# EAGLE design Advanced IMU (EAGLE 6.5.0)
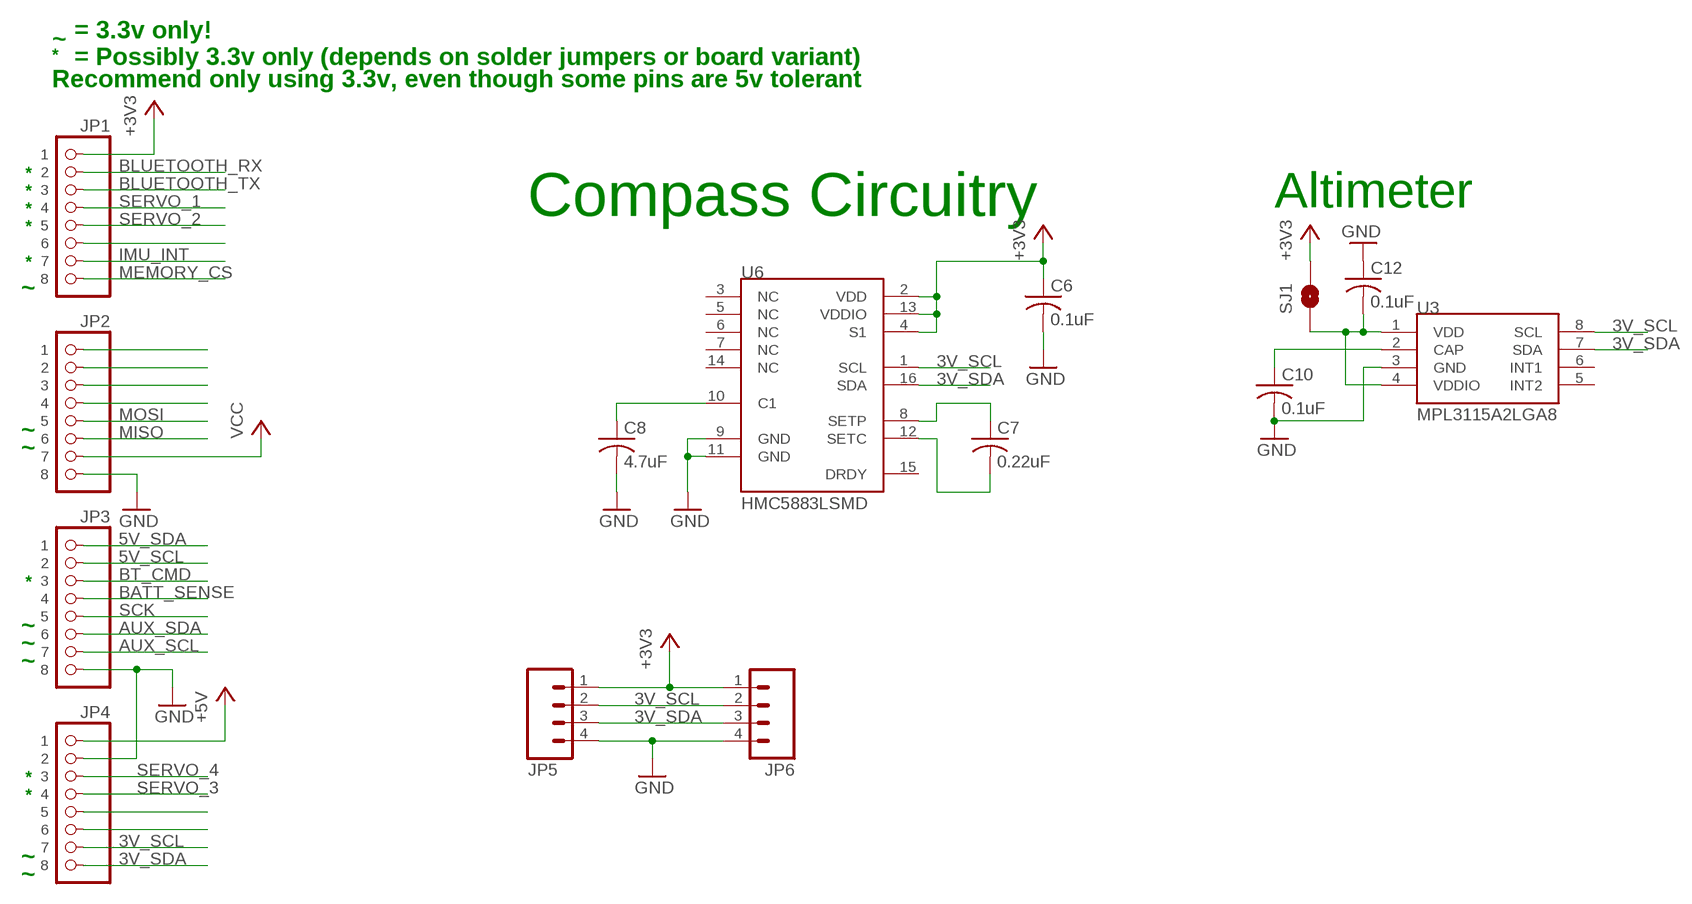
[diagram p0: schematic, sheet 1]

## Parts
C6  0.1uF  C-USC0603  [C0603]
C7  0.22uF  C-USC0603  [C0603]
C8  4.7uF  C-USC0603  [C0603]
C10  0.1uF  C-USC0603  [C0603]
C12  0.1uF  C-USC0603  [C0603]
JP1  8-PIN_HEADER  [8-PIN_RECEPTACLE_LOCK_NO-SS]
JP2  8-PIN_HEADER  [8-PIN_RECEPTACLE_LOCK_NO-SS]
JP3  8-PIN_HEADER  [8-PIN_RECEPTACLE_LOCK_NO-SS]
JP4  8-PIN_HEADER  [8-PIN_RECEPTACLE_LOCK_NO-SS]
JP5  M04PTH  [1X04]
JP6  M04PTH  [1X04]
SJ1  SOLDERJUMPERNC  [SJ_2S]
U3  MPL3115A2LGA8  [LGA8]
U6  HMC5883LSMD  [16LPCC]

## Nets
3V_SCL: JP4.P$7 JP5.2 JP6.2 U3.8(SCL) U6.1(SCL)
3V_SDA: JP4.P$8 JP5.3 JP6.3 U3.7(SDA) U6.16(SDA)
5V_SCL: JP3.P$2
5V_SDA: JP3.P$1
+3V3: C6.1 JP1.P$1 JP5.1 JP6.1 SJ1.2 U6.2(VDD) U6.4(S1) U6.13(VDDIO)
+5V: JP4.P$1
AUX_SCL: JP3.P$7
AUX_SDA: JP3.P$6
BATT_SENSE: JP3.P$4
BLUETOOTH_RX: JP1.P$2
BLUETOOTH_TX: JP1.P$3
BT_CMD: JP3.P$3
GND: C6.2 C8.2 C10.2 C12.1 JP2.P$8 JP3.P$8 JP4.P$2 JP5.4 JP6.4 U3.3(GND) U6.9(GND) U6.11(GND)
IMU_INT: JP1.P$7
MEMORY_CS: JP1.P$8
MISO: JP2.P$6
MOSI: JP2.P$5
N$1: C7.1 U6.8(SETP)
N$2: C7.2 U6.12(SETC)
N$3: C12.2 SJ1.1 U3.1(VDD) U3.4(VDDIO)
N$4: JP2.P$4
N$5: JP2.P$3
N$6: JP2.P$2
N$7: JP2.P$1
N$10: JP1.P$6
N$11: C8.1 U6.10(C1)
N$21: C10.1 U3.2(CAP)
N$26: JP4.P$5
N$27: JP4.P$6
SCK: JP3.P$5
SERVO_1: JP1.P$4
SERVO_2: JP1.P$5
SERVO_3: JP4.P$4
SERVO_4: JP4.P$3
VCC: JP2.P$7
Unconnected: U3.5(INT2) U3.6(INT1) U6.3(NC) U6.5(NC) U6.6(NC) U6.7(NC) U6.14(NC) U6.15(DRDY)

## Notes on the sheet
- = 3.3v only!
- ~
- * | = Possibly 3.3v only (depends on solder jumpers or board variant)
- Recommend only using 3.3v, even though some pins are 5v tolerant
- *
- *
- Altimeter
- * | Compass Circuitry
- *
- *
- ~
- ~
- ~
- *
- ~
- ~
- ~
- *
- *
- ~
- ~

## Library data of the parts
C6 C10 = resistor:C-US: CAPACITOR, American symbol; RATED_VOLTAGE: 2
C7 C8 = resistor:C-US: CAPACITOR, American symbol; ESR: <200mOhms
C12 = resistor:C-US: CAPACITOR, American symbol
JP1-JP4 = My Parts:8-PIN_HEADER
JP5 JP6 = SparkFun-Connectors:M04: Header 4 Standard 4-pin 0.1" header. Use with straight break away headers (SKU : PRT-00116), right angle break away headers (PRT-00553), swiss pins (PRT-00743), machine pins (PRT-00117), and female headers (PRT-00115). Molex polarized connector foot print use with SKU : PRT-08231 with associated crimp pins and housings. 1MM SMD Version SKU: PRT-10208
SJ1 = SparkFun-Passives:SOLDERJUMPER: Solder Jumper Standard SMD solder jumper. Used to automate production. Two varients : Normally Open and Normally Closed are the same, but have different paste layers. NC will have a large amount of paste and should jumper during reflow.
U3 = SparkFun-Sensors:MPL3115A2: Altimeter/Pressure Sensor, I2C, 1.95V-3.6V supply, 50 to 110kPa
U6 = SparkFun:HMC5883L: 3 Axis Digital Compass IC

## Board
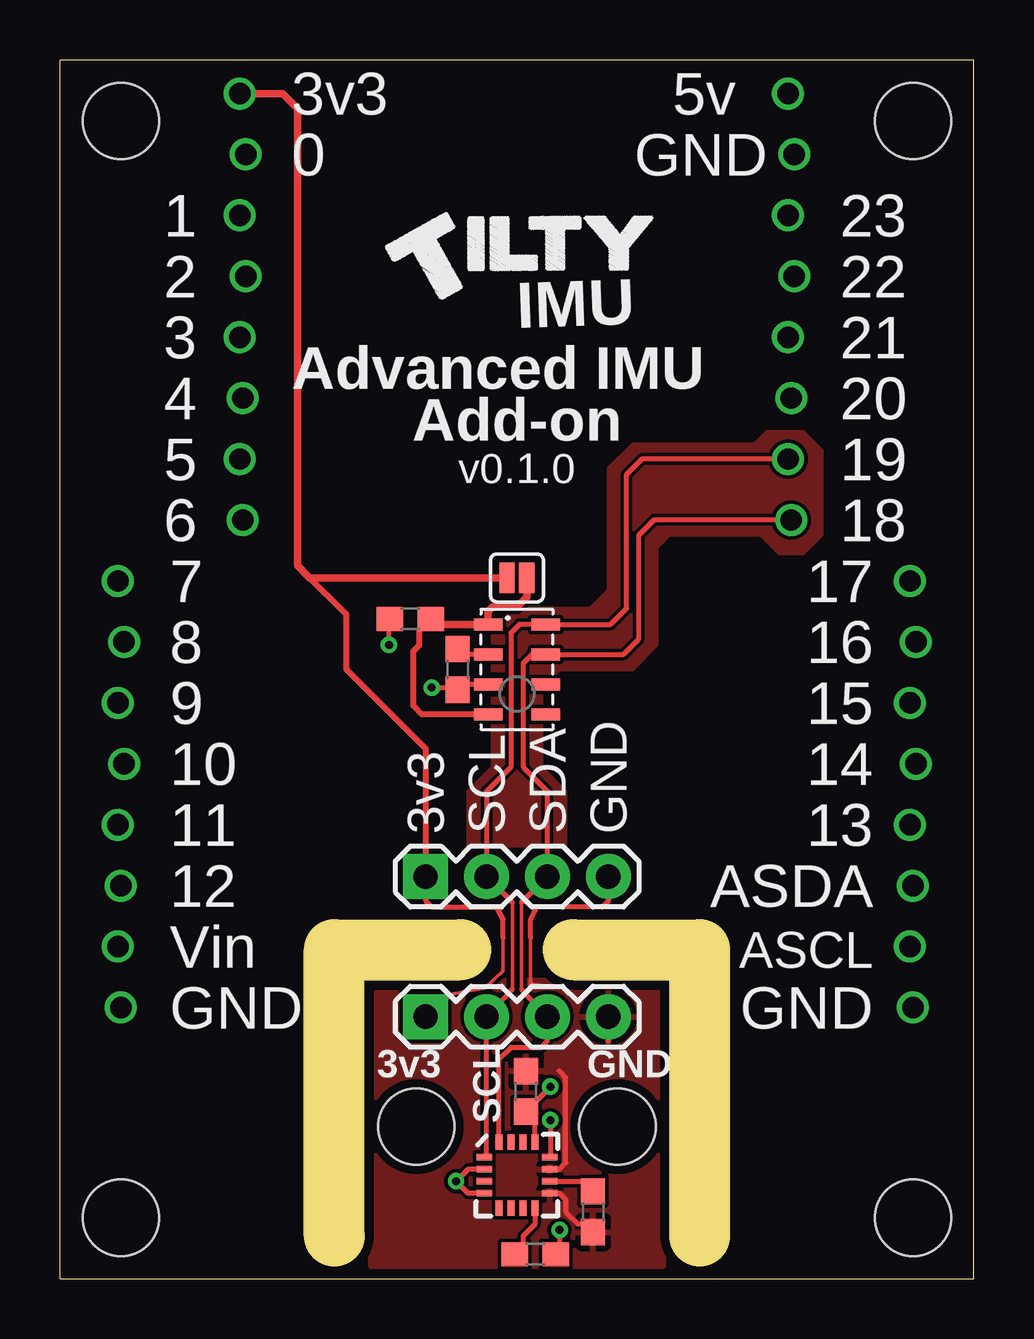
[diagram p1: board, top side]
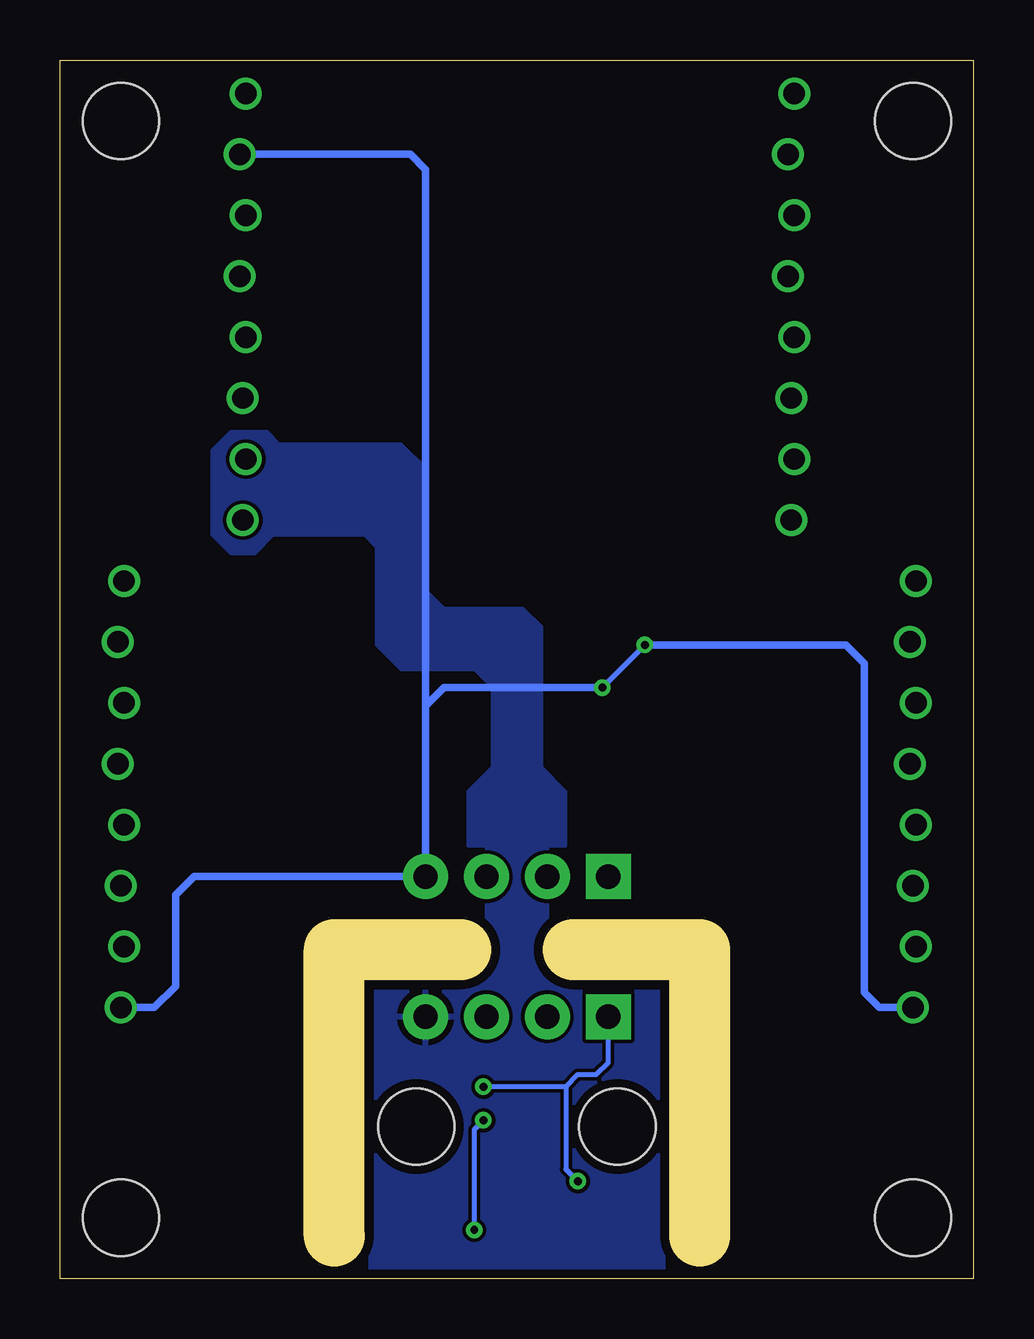
[diagram p2: board, bottom side, seen from below]

Size 38.1 x 50.8 mm. Coordinates in mm from the lower left corner, seen from the top.
Outline: 11.43,1.78 11.43,13.72 16.7,13.72
Outline: 21.4,13.72 26.67,13.72 26.67,1.78
Outline: 38.1,0 38.1,50.8 0,50.8 0,0 38.1,0
Copper layers (1*16): Top 0.0356mm / dielectric 1.5011mm / Bottom 0.0356mm
Design rules "LaenPCBOrder": minimum track width 6mil, minimum drill 13mil, track to track 6mil, track to pad 6mil, pad to pad 6mil, via to via 6mil, smd to smd 6mil, copper to edge 15mil, drill to drill 6mil, minimum pad ring 7mil, minimum via ring 7mil, stop-mask expansion 4mil, vias tented up to drill 0mil, thermal gap 10mil
Holes 3.17 mm at 35.56,48.26 35.56,2.54 2.54,2.54 2.54,48.26 14.86,6.35 23.24,6.35

### Footprints (pad centres in the part's own frame; a part is rotated, then mirrored left to right if it is on the bottom)
C0603 = smd 1.1 x 1: 1 -0.85,0; 2 0.85,0
8-PIN_RECEPTACLE_LOCK_NO-SS = drill 0.889: P$1 -8.89,-0.127; P$2 -6.35,0.127; P$3 -3.81,-0.127; P$4 -1.27,0.127; P$5 1.27,-0.127; P$6 3.81,0; P$7 6.35,-0.127; P$8 8.89,0
1X04 = drill 1.016 pad 1.88 square: 1 0,0 | drill 1.016 pad 1.88: 2 2.54,0; 3 5.08,0; 4 7.62,0
SJ_2S = smd 0.635 x 1.27: 1 -0.412,0; 2 0.412,0
LGA8 = smd 1.2 x 0.5: 1 -1.2,1.875; 2 -1.2,0.625; 3 -1.2,-0.625; 4 -1.2,-1.875; 5 1.2,-1.875; 6 1.2,-0.625; 7 1.2,0.625; 8 1.2,1.875
16LPCC = smd 0.65 x 0.28: 1 -1.37,0.75; 2 -1.37,0.25; 3 -1.37,-0.25; 4 -1.37,-0.75; 9 1.37,-0.75; 10 1.37,-0.25; 11 1.37,0.25; 12 1.37,0.75 | smd 0.28 x 0.65: 5 -0.75,-1.37; 6 -0.25,-1.37; 7 0.25,-1.37; 8 0.75,-1.37; 13 0.75,1.37; 14 0.25,1.37; 15 -0.25,1.37; 16 -0.75,1.37

### Placement (x,y rotation side)
C6  19.43,7.81 90 top
C7  19.81,1.02 0 top
C8  22.23,2.79 270 top
C10  16.57,25.4 270 top
C12  14.61,27.5 0 top
JP1  7.62,40.51 270 top
JP2  2.54,20.19 270 top
JP3  35.56,20.19 270 top
JP4  30.48,40.51 270 top
JP5  15.24,10.92 0 top
JP6  15.24,16.76 0 top
SJ1  19.05,29.21 180 top
U3  19.05,25.4 0 top
U6  19.05,4.32 0 top

### Tracks (layer width: path | path; a pad name or v marks a point on that pad's centre or on a via)
3V_SCL
  Top 0.152: 18.86,12.06 18.86,15.68
  Top 0.203: JP4.P$7 24.26,34.16 23.62,33.53 23.62,27.94 22.96,27.27 U3.8 19.15,27.27 18.8,26.92 18.8,21.34 17.78,20.32 JP6.2 18.86,15.68 | U6.1 17.78,5.07 JP5.2 18.86,12.06
3V_SDA
  Top 0.152: 19.24,12.06 19.24,15.68
  Top 0.203: U6.16 18.3,9.16 18.8,9.65 20.07,9.65 20.32,9.91 JP5.3 19.24,12.06 | JP4.P$8 24.77,31.62 24.13,30.99 24.13,26.67 23.48,26.02 U3.7 19.68,26.02 19.3,25.65 19.3,21.34 20.32,20.32 JP6.3 19.24,15.68
+3V3  (via drill 0.33)
  Top 0.152: 18.48,14.22 18.48,12.83 17.72,12.13 16.38,11.87 JP5.1
  Top 0.203: U6.13 19.8,6.59 C6.1 19.43,6.99 v20.45,8 | U6.4 17.01,3.57 v16.51,4.06 17.01,4.57 U6.2 | JP6.1 15.24,15.75 15.49,15.49 18.22,15.49 18.48,14.99 18.48,14.22
  Top 0.254: JP6.1 15.24,22.1 11.94,25.4 11.94,27.69 10.29,29.34
  Top 0.318: JP1.P$1 9.27,49.4 9.91,48.77 9.91,29.72 10.29,29.34 10.41,29.21 SJ1.2
  Bottom 0.203: 17.01,8.01 16.51,8.51 15.75,8.51 15.24,9.02 JP5.1 | 17.01,8.01 v20.44,8.01 v20.45,8 | 17.02,8 17.01,8.01 | 17.01,8.01 17.01,4.57 v16.51,4.06
GND  (via drill 0.33)
  Top 0.152: 19.62,12.26 19.62,14.22
  Top 0.203: 20.8,8.66 21.08,8.38 21.08,4.83 20.82,4.57 U6.11 | U6.9 20.82,3.57 21.08,3.3 21.08,2.79 21.59,2.29 21.88,2.29 C8.2 | 22.86,9.91 JP5.4 | U3.3 16.73,24.77 C10.2 16.48,24.64 v15.49,24.64 | v13.72,26.42 13.72,27.46 C12.1 | JP6.4 22.86,15.75 22.61,15.49 19.88,15.49 19.62,14.99 19.62,14.22 | 20.07,12.19 19.62,12.26
  Bottom 0.203: v13.72,26.42 v15.49,24.64
  Bottom 0.318: 22.86,23.88 JP6.4 32.51,16.76 33.27,16 33.27,12.19 34.16,11.3 JP3.P$8 | 22.86,23.88 22.1,24.64 v15.49,24.64 | JP4.P$2 23.5,46.86 22.86,46.23 22.86,23.88 | JP2.P$8 3.94,11.3 4.57,11.94 4.57,25.65 5.33,26.42 v13.72,26.42
  pour Bottom: 12.95,12.45 25.15,12.45 25.15,0.25 12.95,0.25
  pour Top: 13.21,12.45 25.15,12.45 25.15,0.51 12.95,0.51 12.95,12.45
  pour Top: 28.96,34.8 23.88,34.8 22.86,33.78 22.86,28.7 22.1,27.94 20.83,27.94 20.83,25.4 23.88,25.4 24.89,26.42 24.89,30.48 25.4,30.99 28.96,30.99 29.21,30.99 29.97,30.23 30.99,30.23 31.75,30.99 31.75,34.54 30.99,35.31 29.46,35.31
  pour Bottom: 20.83,27.94 20.83,25.4 23.88,25.4 24.89,26.42 24.89,30.48 25.4,30.99 29.21,30.99 29.97,30.23 30.99,30.23 31.75,30.99 31.75,34.54 30.99,35.31 29.46,35.31 28.96,34.8 23.88,34.8 22.86,33.78 22.86,28.7 22.1,27.94
  pour Bottom: 20.83,27.94 18.8,27.94 18.03,27.18 18.03,21.34 17.02,20.32 17.02,18.03 21.08,18.03 21.08,20.32 20.07,21.34 20.07,24.64 20.83,25.4
  pour Top: 20.83,27.94 18.8,27.94 18.03,27.18 18.03,21.34 17.02,20.32 17.02,18.03 21.08,18.03 21.08,20.32 20.07,21.34 20.07,24.64 20.83,25.4
  pour Bottom: 17.78,18.03 17.78,12.45 20.32,12.45 20.32,18.03
N$1
  Top 0.203: U6.8 19.8,2.27 19.3,1.78 19.3,1.36 C7.1
N$2  (via drill 0.33)
  Top 0.203: v20.45,6.6 20.45,5.09 U6.12 | v20.83,2.03 20.83,1.18 C7.2
  Bottom 0.203: v20.83,2.03 20.83,6.22 v20.45,6.6
N$3
  Top 0.254: U3.4 15.08,23.52 14.73,23.88 14.73,26.16 14.99,26.42 14.99,27.03 C12.2
  Top 0.318: SJ1.1 19.46,28.41 19.05,28 18.03,28 17.84,27.81 17.84,27.28 U3.1 15.68,27.27 C12.2
N$11
  Top 0.203: U6.10 21.8,4.07 C8.1
N$21
  Top 0.203: U3.2 16.73,26.02 C10.1

### Text on the board
tNames: 3v3 | 5v | 0 | GND | 1 | 23 | 2 | 22 | IMU | 3 | 21 | Advanced IMU | 4 | Add-on | 20 | v0.1.0 | 5 | 19 | 6 | 18 | 7 | 17 | 8 | 16 | 9 | 15 | 10 | 14 | 3v3 | SCL | SDA | GND | 11 | 13 | 12 | ASDA | Vin | ASCL | GND | GND | 3v3 | GND | SCL